# Altium schematic sheet Power Distribution - Heavy Load Driver.SchDoc: Title
size B; Organization: Midnight Sun Solar Rayce Car Team; Address1: University of Waterloo; Address2: 200 University Ave W; Address3: Waterloo, ON, Canada; Address4: N2L 3E9; Website: www.uwmidsun.com; ProjectName: ProjectName
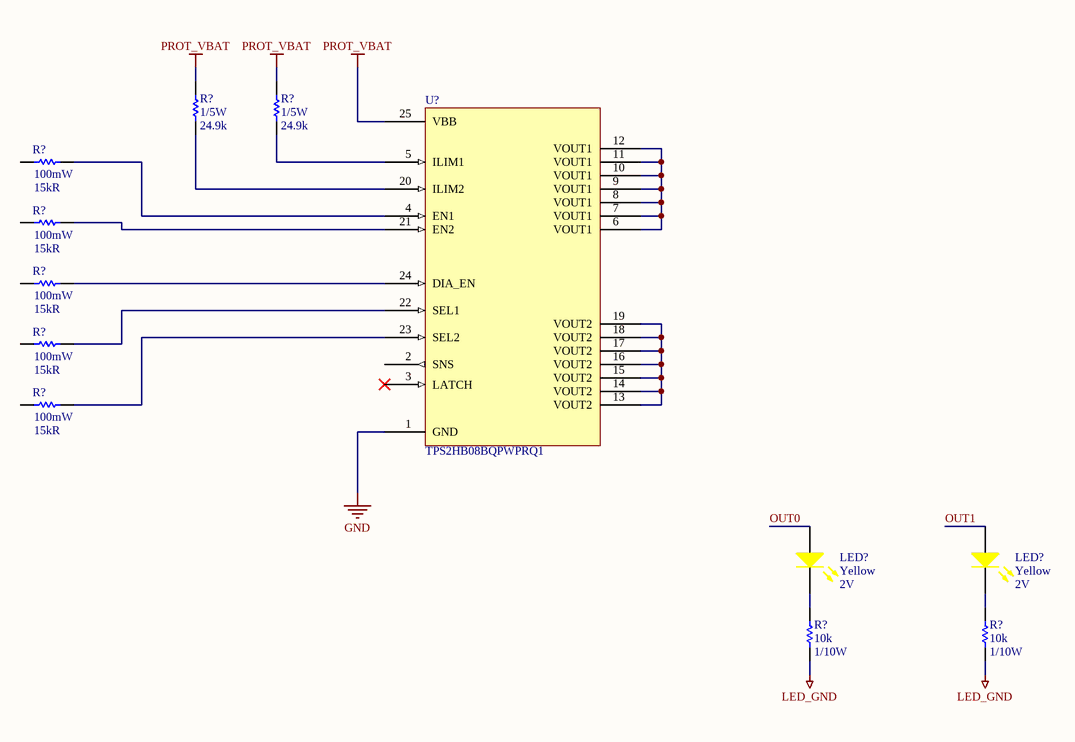
[diagram p0: Power Distribution - Heavy Load Driver.SchDoc]

## Parts
(Parts that share a designator on the sheet are numbered #1, #2 ... from top to bottom, then left to right.)
LED?#1  Color: Yellow  Voltage - Forward (Vf) (Typ): 2V  [LED_0603]  (hidden comment: LED YELLOW CLEAR 2.1V 0603)
LED?#2  Color: Yellow  Voltage - Forward (Vf) (Typ): 2V  [LED_0603]  (hidden comment: LED YELLOW CLEAR 2.1V 0603)
R?#1  Power: 1/5W  Resistance: 24.9k  [RES, 0603]  (hidden comment: RES 24.9K OHM 0.1% 1/5W 0603)
R?#2  Power: 1/5W  Resistance: 24.9k  [RES, 0603]  (hidden comment: RES 24.9K OHM 0.1% 1/5W 0603)
R?#3  Power Rating: 100mW  Resistance: 15kR  [RES, 0603]  (hidden comment: RES SMD 15K OHM 1% 1/10W 0603)
R?#4  Power Rating: 100mW  Resistance: 15kR  [RES, 0603]  (hidden comment: RES SMD 15K OHM 1% 1/10W 0603)
R?#5  Power Rating: 100mW  Resistance: 15kR  [RES, 0603]  (hidden comment: RES SMD 15K OHM 1% 1/10W 0603)
R?#6  Power Rating: 100mW  Resistance: 15kR  [RES, 0603]  (hidden comment: RES SMD 15K OHM 1% 1/10W 0603)
R?#7  Power Rating: 100mW  Resistance: 15kR  [RES, 0603]  (hidden comment: RES SMD 15K OHM 1% 1/10W 0603)
R?#8  Resistance: 10k  Power: 1/10W  [RES, 0603]  (hidden comment: RES 10K OHM 1% 1/10W 0603)
R?#9  Resistance: 10k  Power: 1/10W  [RES, 0603]  (hidden comment: RES 10K OHM 1% 1/10W 0603)
U?  Manufacturer Part Number: TPS2HB08BQPWPRQ1  [IC TPS2HB08-Q1 PowerPAD TSSOP-24]  (hidden comment: IC LOAD SWITCH TPS2HB08BQPWPRQ1 24-TSSOP)

## Nets
GND: U?.1(GND)
LED_GND: R?#8.2 R?#9.2
PROT_VBAT: R?#1.2 R?#2.2 U?.25(VBB)
OUT0: LED?#1.1(A)
OUT1: LED?#2.1(A)
NetLED?#1_2: LED?#1.2(K) R?#8.1
NetLED?#2_2: LED?#2.2(K) R?#9.1
NetR?#1_1: R?#1.1 U?.20(ILIM2)
NetR?#2_1: R?#2.1 U?.5(ILIM1)
NetR?#3_2: R?#3.2 U?.4(EN1)
NetR?#4_2: R?#4.2 U?.21(EN2)
NetR?#5_2: R?#5.2 U?.24(DIA_EN)
NetR?#6_2: R?#6.2 U?.22(SEL1)
NetR?#7_2: R?#7.2 U?.23(SEL2)
NetU?_6: U?.6(VOUT1) U?.7(VOUT1) U?.8(VOUT1) U?.9(VOUT1) U?.10(VOUT1) U?.11(VOUT1) U?.12(VOUT1)
NetU?_13: U?.13(VOUT2) U?.14(VOUT2) U?.15(VOUT2) U?.16(VOUT2) U?.17(VOUT2) U?.18(VOUT2) U?.19(VOUT2)

Not connected (* = marked no-connect by the designer): R?#3 1; R?#4 1; R?#5 1; R?#6 1; R?#7 1; U? 2(SNS) 3(LATCH)*

## Notes on the sheet
- PROJECT
- DOCUMENT
- DRAWN BY
- LAST MODIFIED
- PART NUMBER
- REVISION
- SHEET
- VARIANT
- OF
- Engineering 5 - 1002
  University of Waterloo
  (519) 888-4567 x32978
  hardware@uwmidsun.com

## Library data of the parts
LED?#1 LED?#2 = LED YELLOW CLEAR 2.1V 0603: Yellow 590nm LED Indication - Discrete 2V 0603 (1608 Metric); Manufacturer: Wurth Electronics Inc.; Manufacturer Part Number: 150060YS75000; Lens Color: Colorless; Millicandela Rating: 120mcd; Lens Style/Size: Rectangle with Flat Top, 1.10mm x 0.70mm; Current - Test: 20mA; Viewing Angle: 140°; Wavelength - Peak: 595nm; Supplier 1: Digi-Key; RoHS: RoHS Compliant; Category: Optoelectronics; Stock 1: 10523; Pricing 1: 1=0.21, 100=0.1617, 500=0.13964 (CAD); Packaging: Cut Tape (CT); Part Status: Active; Lens Transparency: Clear; Mounting Type: Surface Mount; Wavelength - Dominant: 590nm; Features: -; Package / Case: 0603 (1608 Metric); Supplier Device Package: 0603; Size / Dimension: 1.60mm L x 0.80mm W; Height (Max): 0.80mm; ComponentLink1URL: http://katalog.we-online.de/led/datasheet/150060YS75000.pdf; ComponentLink1Description: http://katalog.we-online.de/led/datasheet/150060YS75000.pdf; Supplier Part Number 1: 732-4981-1-ND
R?#1 R?#2 = RES 24.9K OHM 0.1% 1/5W 0603: 24.9 kOhms ±0.1% 0.2W, 1/5W Chip Resistor 0603 (1608 Metric) Automotive AEC-Q200, Pulse Withstanding Thick Film; Manufacturer: Panasonic; Manufacturer Part Number: ERJPB3B2492V; Max Power Dissipation: 200mW; Temperature Coefficient: 50ppm/°C; Supplier 1: Digi-Key; Supplier Part Number 1: P20129CT-ND; Stock 1: 2; Pricing 1: 1=0.25000, 10=0.21100, 25=0.15320, 50=0.11100, 100=0.08230, 250=0.06316, 500=0.04976, 1000=0.03445 (USD); RoHS: Yes; Case/Package: 0603; Case Code (Metric): 1608; Case Code (Imperial): 0603; Min Operating Temperature: -55°C; Max Operating Temperature: 155°C; Packaging: Tape and Reel; Composition: Thick Film; Number of Terminations: 2; Tolerance: 0.1%; Features: Automotive AEC-Q200; Length: 0.063inch; Width: 0.032inch; Height - Seated (Max): 0.022inch; ComponentLink1URL: http://www.farnell.com/datasheets/2286937.pdf?src-supplier=Farnell; ComponentLink1Description: http://www.farnell.com/datasheets/2286937.pdf?src-supplier=Farnell; ComponentLink2URL: https://industrial.panasonic.com/sa/system/files/data/download/catalog/id_fixed-resistors_e_2.pdf?src-supplier=Digi-Key; ComponentLink2Description: https://industrial.panasonic.com/sa/system/files/data/download/catalog/id_fixed-resistors_e_2.pdf?src-supplier=Digi-Key; ComponentLink3URL: https://industrial.panasonic.com/cdbs/www-data/pdf/RDM0000/DMM0000COL5.pdf?src-supplier=Digi-Key; ComponentLink3Description: https://industrial.panasonic.com/cdbs/www-data/pdf/RDM0000/DMM0000COL5.pdf?src-supplier=Digi-Key; ComponentLink4URL: http://www.farnell.com/datasheets/2286937.pdf?src-supplier=Newark; ComponentLink4Description: http://www.farnell.com/datasheets/2286937.pdf?src-supplier=Newark
R?#3-R?#7 = RES SMD 15K OHM 1% 1/10W 0603: 15 kOhms ±1% 0.1W, 1/10W Chip Resistor 0603 (1608 Metric) Moisture Resistant Thick Film; Manufacturer: Yageo; Manufacturer Part Number: RC0603FR-0715KL; Temperature Coefficient: 100ppm/°C; Voltage Rating (DC): 50V; Supplier 1: Digi-Key; RoHS: Yes; Stock 1: 8520111; Pricing 1: 1 = 0.10000, 10 = 0.02400, 100 = 0.00970, 1000 = 0.00437, 2500 = 0.00379 (USD); Case/Package: 0603; Number of Pins: 2; Case Code (Metric): 1608; Case Code (Imperial): 0603; Min Operating Temperature: -55°C; Max Operating Temperature: 155°C; Tolerance: 1%; Packaging: Tape and Reel; Composition: Thick Film; Package Quantity: 1; Voltage Rating: 50V; Number of Terminations: 2; Termination: SMD/SMT; Military Standard: Not; Max Power Dissipation: 100mW; Features: Moisture Resistant; Length: 1.6mm; Height: 0.022inch; Width: 0.031inch; Depth: 0.8mm; REACH SVHC: Unknown; Lead Free: Lead Free; ComponentLink1URL: http://www.yageo.com/documents/recent/PYu-RC_Group_51_RoHS_L_10.pdf; ComponentLink1Description: http://www.yageo.com/documents/recent/PYu-RC_Group_51_RoHS_L_10.pdf; ComponentLink2URL: http://www.yageo.com/documents/recent/PYu-RC_Group_51_RoHS_L_9.pdf; ComponentLink2Description: http://www.yageo.com/documents/recent/PYu-RC_Group_51_RoHS_L_9.pdf; ComponentLink3URL: https://www.verical.com/server-webapp/html/getDatasheet?partID=327895; ComponentLink3Description: https://www.verical.com/server-webapp/html/getDatasheet?partID=327895; Supplier Part Number 1: 311-15.0KHRCT-ND
R?#8 R?#9 = RES 10K OHM 1% 1/10W 0603: RES SMD 10K OHM 1% 1/10W 0603; Manufacturer 1: Yageo; Manufacturer Part Number 1: RC0603FR-0710KL; Temperature Coefficient: ±100ppm/°C; Supplier 1: Digi-Key; Supplier Part Number 1: 311-10.0KHRCT-ND; Packaging: Cut Tape (CT); Part Status: Active; Composition: Thick Film; Operating Temperature: -55°C ~ 155°C; Package / Case: 0603 (1608 Metric); Supplier Device Package: 0603; Size / Dimension: 0.063" L x 0.031" W (1.60mm x 0.80mm); Height - Seated (Max): 0.022" (0.55mm); Failure Rate: -; ComponentLink1URL: http://www.yageo.com/documents/recent/PYu-RC_Group_51_RoHS_L_7.pdf; ComponentLink1Description: http://www.yageo.com/documents/recent/PYu-RC_Group_51_RoHS_L_7.pdf; Tolerance: ±1%
U? = IC LOAD SWITCH TPS2HB08BQPWPRQ1 24-TSSOP: Power Switch ICs - Power Distribution HYDRA 8 MOHM OTP B; Manufacturer: Texas Instruments; Supplier 1: Mouser; Supplier Part Number 1: 595-TPS2HB08BQPWPRQ1; Stock 1: 1455; Pricing 1: 1=6.26000, 10=5.63000, 50=5.63000, 100=4.61000, 1000=3.31000, 10000=3.14000 (USD); ComponentLink1URL: https://octopart.com/click/track?ak=2673a2b2&ct=datasheets&sig=00f1c14&at=physicalpart&sid=370&ppid=97400712&hlid=26833906&src-supplier=TI+store; ComponentLink1Description: https://octopart.com/click/track?ak=2673a2b2&ct=datasheets&sig=00f1c14&at=physicalpart&sid=370&ppid=97400712&hlid=26833906&src-supplier=TI+store; ComponentLink2URL: http://sigma.octopart.com/49250897/technical_drawing/Texas-Instruments-TPS2HB08BQPWPRQ1.pdf?src-supplier=TI+store; ComponentLink2Description: http://sigma.octopart.com/49250897/technical_drawing/Texas-Instruments-TPS2HB08BQPWPRQ1.pdf?src-supplier=TI+store